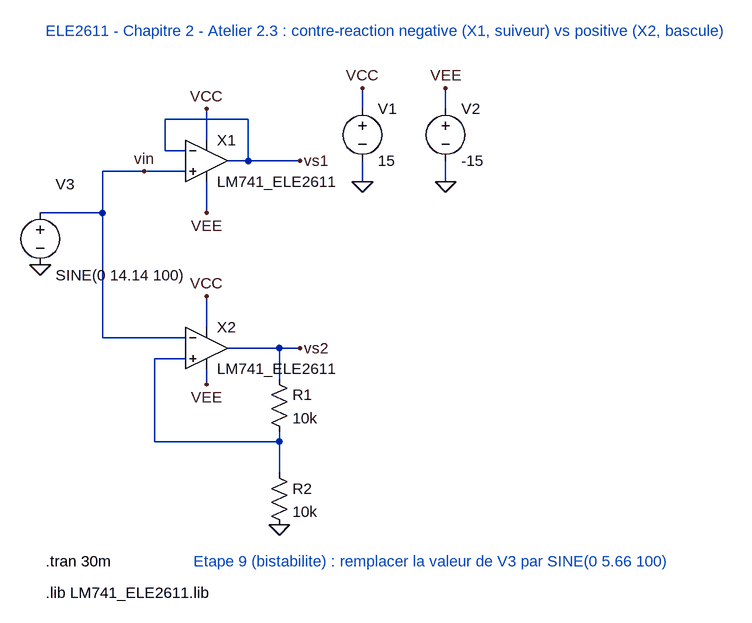
[diagram p0: schematic Ch2_Atelier_2_3_CRneg_vs_CRpos.asc]
Ch2_Atelier_2_3_CRneg_vs_CRpos.asc, the LTspice schematic file:
Version 4
SHEET 1 1200 1000
WIRE 64 320 160 320
WIRE 160 256 160 512
WIRE 160 256 224 256
WIRE 224 256 288 256
WIRE 160 512 288 512
WIRE 352 240 384 240
WIRE 384 176 384 240
WIRE 256 176 384 176
WIRE 256 176 256 224
WIRE 256 224 288 224
WIRE 384 240 464 240
WIRE 320 160 320 208
WIRE 320 272 320 320
WIRE 240 544 288 544
WIRE 240 544 240 672
WIRE 240 672 432 672
WIRE 352 528 464 528
WIRE 432 528 432 576
WIRE 432 656 432 704
WIRE 432 704 432 720
WIRE 320 448 320 496
WIRE 320 560 320 584
WIRE 560 128 560 160
WIRE 560 240 560 272
WIRE 688 128 688 160
WIRE 688 240 688 272
FLAG 64 400 0
FLAG 224 256 vin
FLAG 320 160 VCC
FLAG 320 320 VEE
FLAG 464 240 vs1
FLAG 320 448 VCC
FLAG 320 584 VEE
FLAG 464 528 vs2
FLAG 432 800 0
FLAG 560 128 VCC
FLAG 560 272 0
FLAG 688 128 VEE
FLAG 688 272 0
SYMBOL voltage 64 304 R0
WINDOW 0 24 -28 Left 2
WINDOW 3 24 112 Left 2
SYMATTR InstName V3
SYMATTR Value SINE(0 14.14 100)
SYMBOL Opamps\\opamp2 320 176 R0
SYMATTR InstName X1
SYMATTR Value LM741_ELE2611
SYMBOL Opamps\\opamp2 320 464 R0
SYMATTR InstName X2
SYMATTR Value LM741_ELE2611
SYMBOL res 416 560 R0
SYMATTR InstName R1
SYMATTR Value 10k
SYMBOL res 416 704 R0
SYMATTR InstName R2
SYMATTR Value 10k
SYMBOL voltage 560 144 R0
SYMATTR InstName V1
SYMATTR Value 15
SYMBOL voltage 688 144 R0
SYMATTR InstName V2
SYMATTR Value -15
TEXT 72 40 Left 2 ;ELE2611 - Chapitre 2 - Atelier 2.3 : contre-reaction negative (X1, suiveur) vs positive (X2, bascule)
TEXT 72 856 Left 2 !.tran 30m
TEXT 300 856 Left 2 ;Etape 9 (bistabilite) : remplacer la valeur de V3 par SINE(0 5.66 100)
TEXT 72 904 Left 2 !.lib LM741_ELE2611.lib

The netlist it stands for:
* Ch2_Atelier_2_3_CRneg_vs_CRpos.asc
V3 vin 0 SINE(0 14.14 100)
XX1 vin vs1 VCC VEE vs1 LM741_ELE2611  ; pins In+ In- V+ V- OUT
XX2 N001 vin VCC VEE vs2 LM741_ELE2611  ; pins In+ In- V+ V- OUT
R1 vs2 N001 10k
R2 N001 0 10k
V1 VCC 0 15
V2 VEE 0 -15
* ELE2611 - Chapitre 2 - Atelier 2.3 : contre-reaction negative (X1, suiveur) vs positive (X2, bascule)
.tran 30m
* Etape 9 (bistabilite) : remplacer la valeur de V3 par SINE(0 5.66 100)
.lib LM741_ELE2611.lib
.backanno
.end